# Altium project LSS_Top_Board_v3.4.PrjPcb (part 3 of 3)

## Sheet Connector-Section.SchDoc
size A4; DocumentNumber: 9; SheetNumber: 9; SheetTotal: 10
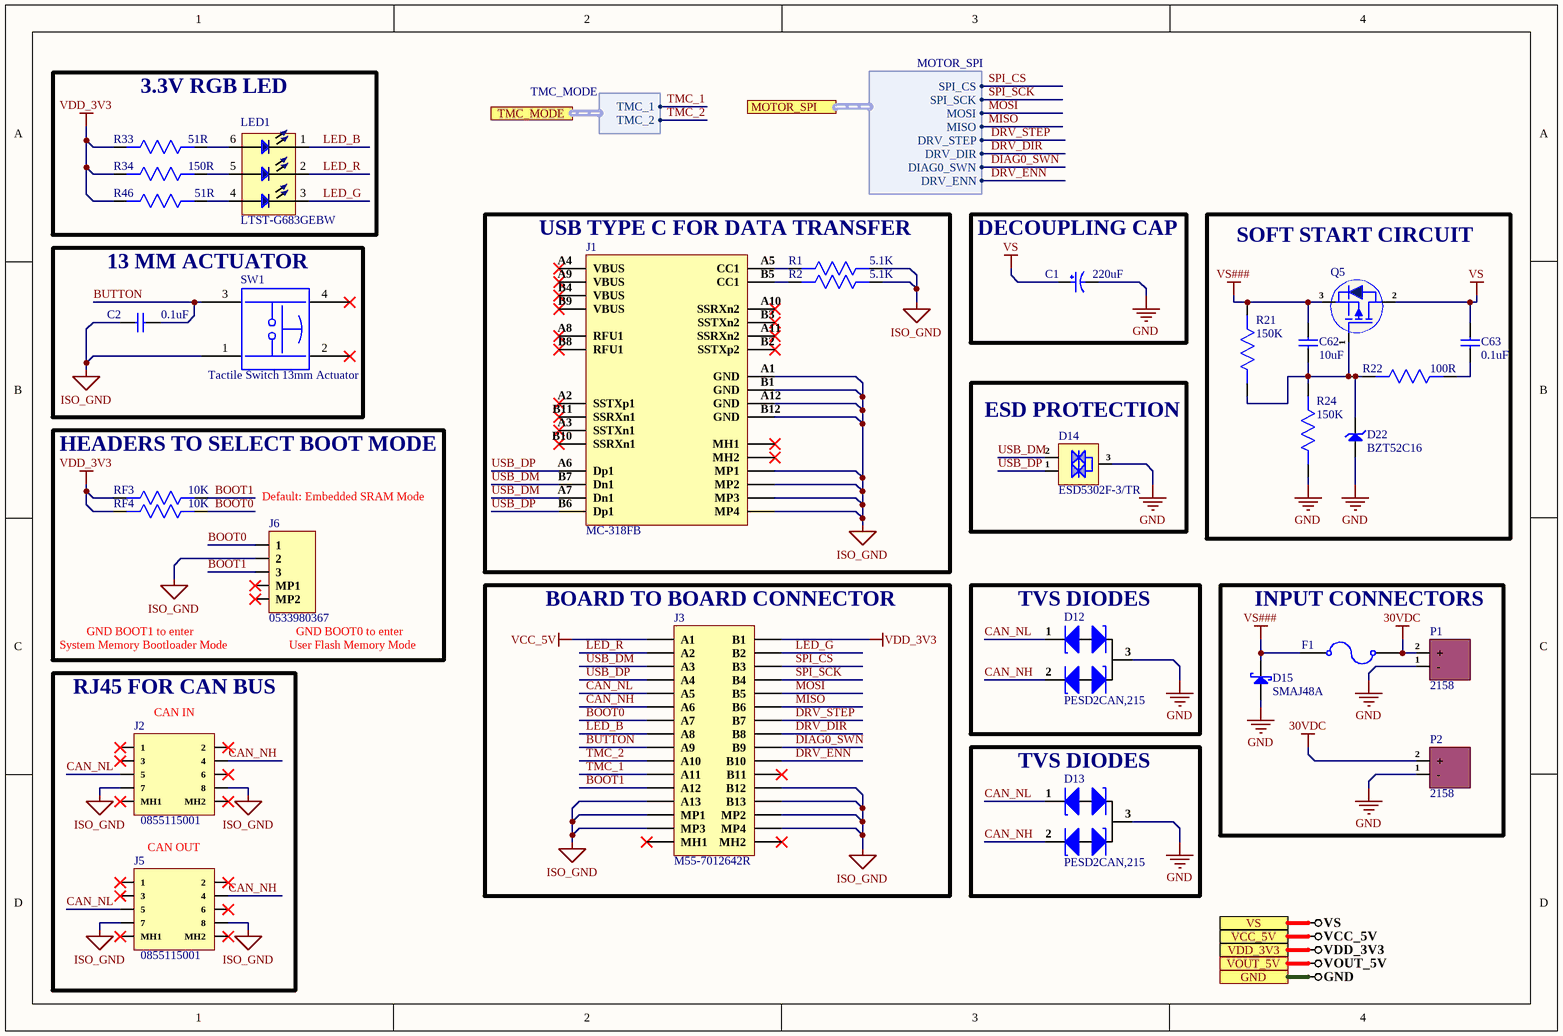
[diagram p3: Connector-Section.SchDoc]

### Parts
C1  220uF  [EEEFT1H221AP]
C2  0.1uF  [Cap 0603]
C62  10uF  [Cap 0603]
C63  0.1uF  [Cap 0603]
D12  PESD2CAN,215  [SOT-23]
D13  PESD2CAN,215  [SOT-23]
D14  ESD5302F-3/TR  [Sot-23]
D15  SMAJ48A  [SMA]
D22  BZT52C16  [SOD-123]
F1  0685H9150-01  [0685H9150-01]  (value not drawn)
J1  MC-318FB  [MC-318FB]
J2  0855115001  [0855115001]
J3  M55-7012642R  [M55-7012642R]
J5  0855115001  [0855115001]
J6  0533980367  [0533980367]
LED1  LTST-G683GEBW  [LTST-G683GEBW]
P1  2158  [2158]
P2  2158  [2158]
Q5  STD10P6F6  [DPAK]  (value not drawn)
R1  5.1K  [Res0603]
R2  5.1K  [Res0603]
R21  150K  [Res0603]
R22  100R  [Res0603]
R24  150K  [Res0603]
R33  51R  [Res0603]
R34  150R  [Res0603]
R46  51R  [Res0603]
RF3  10K  [Res0603]
RF4  10K  [Res0603]
SW1  Tactile Switch 13mm Actuator  [Tactile Switch 13mm Actuator]

### Blocks framed on the sheet
3.3V RGB LED: LED1 R33 R34 R46
USB TYPE C FOR DATA TRANSFER: J1 R1 R2
DECOUPLING CAP: C1
SOFT START CIRCUIT: C62 C63 D22 Q5 R21 R22 R24
13 MM ACTUATOR: C2 SW1
ESD PROTECTION: D14
HEADERS TO SELECT BOOT MODE: J6 RF3 RF4
BOARD TO BOARD CONNECTOR: J3
TVS DIODES: D12
INPUT CONNECTORS: D15 F1 P1 P2
RJ45 FOR CAN BUS: J2 J5
TVS DIODES: D13

### Ports
GND, MOTOR_SPI (harness MOTOR_SPI), TMC_MODE (harness TMC_MODE), VCC_5V, VDD_3V3, VOUT_5V, VS

### Harnesses
TMC_MODE: TMC_1, TMC_2
MOTOR_SPI: SPI_CS, SPI_SCK, MOSI, MISO, DRV_STEP, DRV_DIR, DRV_ENN, DIAG0_SWN

### Nets
30VDC: F1.2 P1.2(+) P2.2(+)
GND: C1.2 D12.3(C_K) D13.3(C_K) D14.3(GND) D15.2(A) D22.1(A) P1.1(-) P2.1(-) R24.2 ; port GND
ISO_GND: C2.1 J1.A1(GND) J1.A12(GND) J1.B1(GND) J1.B12(GND) J1.MP1 J1.MP2 J1.MP3 J1.MP4 J2.7 J2.8 J3.A13 J3.B12 J3.B13 J3.MP1 J3.MP2 J3.MP3 J3.MP4 J5.7 J5.8 J6.2 R1.1 R2.1 SW1.1
VCC_5V: J3.A1 ; port VCC_5V  [project net 5V]
VDD_3V3: J3.B1 R33.2 R34.2 R46.2 RF3.2 RF4.2 ; port VDD_3V3
VS: C1.1 C63.2 Q5.2(D) ; port VS
VS###: C62.2 D15.1(K) F1.1 Q5.3(S) R21.1
BOOT0: J3.A7 J6.1 RF4.1
BOOT1: J3.A12 J6.3 RF3.1
BUTTON: C2.2 J3.A9 SW1.3
CAN_NH: D12.2(K2) D13.2(K2) J2.4 J3.A6 J5.4
CAN_NL: D12.1(K1) D13.1(K1) J2.5 J3.A5 J5.5
DIAG0_SWN: J3.B9 ; port MOTOR_SPI.DIAG0_SWN
DRV_DIR: J3.B8 ; port MOTOR_SPI.DRV_DIR
DRV_ENN: J3.B10 ; port MOTOR_SPI.DRV_ENN
DRV_STEP: J3.B7 ; port MOTOR_SPI.DRV_STEP
LED_B: J3.A8 LED1.1(-)
LED_G: J3.B2 LED1.3(-)
LED_R: J3.A2 LED1.2(-)
MISO: J3.B6 ; port MOTOR_SPI.MISO
MOSI: J3.B5 ; port MOTOR_SPI.MOSI
SPI_CS: J3.B3 ; port MOTOR_SPI.SPI_CS
SPI_SCK: J3.B4 ; port MOTOR_SPI.SPI_SCK
TMC_1: J3.A11 ; port TMC_MODE.TMC_1
TMC_2: J3.A10 ; port TMC_MODE.TMC_2
USB_DM: D14.2(I/O2) J1.A7(Dn1) J1.B7(Dn1) J3.A3
USB_DP: D14.1(I/O1) J1.A6(Dp1) J1.B6(Dp1) J3.A4
NetC62_1: C62.1 D22.2(K) Q5.1(G) R21.2 R22.2 R24.1
NetC63_1: C63.1 R22.1
NetJ1_A5: J1.A5(CC1) R1.2
NetJ1_B5: J1.B5(CC1) R2.2
NetLED1_4: LED1.4(+) R46.1
NetLED1_5: LED1.5(+) R34.1
NetLED1_6: LED1.6(+) R33.1

Not connected (* = marked no-connect by the designer): J1 A2(SSTXp1)* A3(SSTXn1)* A4(VBUS)* A8(RFU1)* A9(VBUS)* A10(SSRXn2)* A11(SSRXn2)* B2(SSTXp2)* B3(SSTXn2)* B4(VBUS)* B8(RFU1)* B9(VBUS)* B10(SSRXn1)* B11(SSRXn1)* MH1* MH2*; J2 1* 2* 3* 6* MH1* MH2*; J3 B11* MH1* MH2*; J5 1* 2* 3* 6* MH1* MH2*; J6 MP1* MP2*; SW1 2* 4*

### Notes on the sheet
- (near J6) Default: Embedded SRAM Mode
- (near J6) System Memory Bootloader Mode
- GND BOOT1 to enter
- (near J6) User Flash Memory Mode
- (near J6) GND BOOT0 to enter
- (near J2) CAN IN
- CAN OUT

### Library data of the parts
C1 = EEEFT1H221AP: CAP ALUM 220UF 20% 50V SMD; Manufacturer: Panasonic; Dielectric Material: Aluminium; Ripple Current: 670mA; ESR (Equivalent Series Resistance): 180mR; Life (Hours): 2000Hour; Leakage Current: 110uA; Lead Diameter: 0.9mm; Item Type: Capacitor; Supplier 1: Avnet; Manufacturer Part Number: EEEFT1H221AP; RoHS: Yes; Category: Aluminum Electrolytic Capacitors; Stock 1: 22638; Pricing 1: 1=1.43000, 10=1.11000, 25=1.01000, 50=0.90500, 100=0.80400 (USD); Mount: Surface Mount,PCB; Case/Package: Radial; Number of Pins: 2; Contact Plating: Tin; Min Operating Temperature: -55°C; Max Operating Temperature: 105°C; Capacitance: 220uF; Voltage Rating: 50V; Tolerance: 20%; Packaging: Tape and Reel; Package Quantity: 500; Ripple Current (AC): 670mA; Voltage Rating (DC): 50V; Termination: SMD/SMT; Voltage: 50V; Series: FT; Construction: Cylindrical; Diameter: 8mm; Length: 10.2mm; Height: 10.2mm; Lead Pitch: 3.1mm; Height - Seated (Max): 0.413inch; Ratings: AEC-Q200; Radiation Hardening: No; Reach SVHC Compliant: Yes; Lead Free: Lead Free; RoHS Compliant: Yes; ComponentLink1URL: https://datasheet.ciiva.com/11783/0900766b80f4973e-11783665.pdf?src-supplier=RSComponents; ComponentLink1Description: https://datasheet.ciiva.com/11783/0900766b80f4973e-11783665.pdf?src-supplier=RSComponents; ComponentLink2URL: https://datasheet.ciiva.com/48523/smd-ft-eng-tds-48523263.pdf?src-supplier=Distrelec; ComponentLink2Description: https://datasheet.ciiva.com/48523/smd-ft-eng-tds-48523263.pdf?src-supplier=Distrelec; ComponentLink3URL: https://datasheet.ciiva.com/43458/1790597-43458703.pdf?src-supplier=Farnell; ComponentLink3Description: https://datasheet.ciiva.com/43458/1790597-43458703.pdf?src-supplier=Farnell; ComponentLink4URL: https://datasheet.ciiva.com/6025/1790597-6025836.pdf?src-supplier=Farnell; ComponentLink4Description: https://datasheet.ciiva.com/6025/1790597-6025836.pdf?src-supplier=Farnell; ComponentLink5URL: https://datasheet.ciiva.com/46376/1790597-46376766.pdf?src-supplier=Element14; ComponentLink5Description: https://datasheet.ciiva.com/46376/1790597-46376766.pdf?src-supplier=Element14; ComponentLink6URL: https://datasheet.ciiva.com/28691/1244238-28691159.pdf?src-supplier=Element14; ComponentLink6Description: https://datasheet.ciiva.com/28691/1244238-28691159.pdf?src-supplier=Element14; ComponentLink7URL: https://datasheet.ciiva.com/28691/1244238-28691150.pdf?src-supplier=Element14; ComponentLink7Description: https://datasheet.ciiva.com/28691/1244238-28691150.pdf?src-supplier=Element14; ComponentLink8URL: https://datasheet.ciiva.com/46385/1790597-46385166.pdf?src-supplier=Element14; ComponentLink8Description: https://datasheet.ciiva.com/46385/1790597-46385166.pdf?src-supplier=Element14; ComponentLink9URL: https://datasheet.ciiva.com/24070/aba0000ce135-31031-24070059.pdf?src-supplier=Mouser; ComponentLink9Description: https://datasheet.ciiva.com/24070/aba0000ce135-31031-24070059.pdf?src-supplier=Mouser; ComponentLink10URL: https://datasheet.ciiva.com/14599/70243693-14599500.pdf?src-supplier=Allied+Electronics; ComponentLink10Description: https://datasheet.ciiva.com/14599/70243693-14599500.pdf?src-supplier=Allied+Electronics; ComponentLink11URL: https://datasheet.ciiva.com/14607/70243693-14607598.pdf?src-supplier=Allied+Electronics; ComponentLink11Description: https://datasheet.ciiva.com/14607/70243693-14607598.pdf?src-supplier=Allied+Electronics; ComponentLink12URL: https://datasheet.ciiva.com/14606/70243693-14606280.pdf?src-supplier=Allied+Electronics; ComponentLink12Description: https://datasheet.ciiva.com/14606/70243693-14606280.pdf?src-supplier=Allied+Electronics; ComponentLink13URL: https://datasheet.ciiva.com/10331/aba0000ce135-10331093.pdf?src-supplier=Avnet; ComponentLink13Description: https://datasheet.ciiva.com/10331/aba0000ce135-10331093.pdf?src-supplier=Avnet; ComponentLink14URL: https://datasheet.ciiva.com/30060/aba0000ce135-30060199.pdf?src-supplier=Onlinecomponents.com; ComponentLink14Description: https://datasheet.ciiva.com/30060/aba0000ce135-30060199.pdf?src-supplier=Onlinecomponents.com; Supplier Part Number 1: 31T8183; LCSC Part Number: C178594
C2 C63 = CL10B104KB8NNNC: Cap Ceramic 0.1uF 50VDC X7R 10% SMD 0603 Paper T/R; Manufacturer: Samsung; Capacitance: 100nF; Voltage Rating: 50V; Supplier 1: Digi-Key; Manufacturer Part Number: CL10B104KB8NNNC; RoHS: Yes; Category: Ceramic Capacitors; Stock 1: 3998791; Pricing 1: 1=0.10000, 10=0.03000, 50=0.01640, 100=0.01340, 500=0.00954, 1000=0.00750 (USD); Mount: Surface Mount; Case/Package: 0603; Case Code (Metric): 1608; Case Code (Imperial): 0603; Material: Ceramic; Contact Plating: Tin; Min Operating Temperature: -55°C; Max Operating Temperature: 125°C; Dielectric: X7R; Tolerance: 10%; Package Quantity: 1; Packaging: Tape and Reel; Voltage: 50V; Voltage Rating (DC): 50V; Series: CL; Construction: Flat; Length: 1.6mm; Width: 0.031inch; Height: 0.8mm; Depth: 0.8mm; Thickness: 0.035inch; Radiation Hardening: No; Lead Free: Lead Free; RoHS Compliant: Yes; ComponentLink1URL: https://datasheet.ciiva.com/25803/cl10b104kb8nnnc-25803393.pdf?src-supplier=Digi-Key; ComponentLink1Description: https://datasheet.ciiva.com/25803/cl10b104kb8nnnc-25803393.pdf?src-supplier=Digi-Key; ComponentLink2URL: https://datasheet.ciiva.com/26838/getdatasheetpartid-89097-26838411.pdf?src-supplier=Verical; ComponentLink2Description: https://datasheet.ciiva.com/26838/getdatasheetpartid-89097-26838411.pdf?src-supplier=Verical; ComponentLink3URL: https://datasheet.ciiva.com/29198/456651-da-01-en-vs-kondensator-0605-29198839.pdf?src-supplier=Conrad; ComponentLink3Description: https://datasheet.ciiva.com/29198/456651-da-01-en-vs-kondensator-0605-29198839.pdf?src-supplier=Conrad; Supplier Part Number 1: 1276-1000-1-ND
C62 = GRM188R6YA106MA73D: 10uF 35V X5R 20% Pad SMD 0603; Manufacturer: Murata; Supplier 1: Arrow Electronics; Manufacturer Part Number: GRM188R6YA106MA73D; RoHS: Yes; Category: Ceramic Capacitors; Stock 1: 37601; Pricing 1: 1=0.36650, 10=0.23380, 25=0.23160, 100=0.15050, 250=0.14890, 500=0.10700, 1000=0.09270, 3000=0.08640, 6000=0.07720, 15000=0.07140, 30000=0.05840 (USD); Mount: Surface Mount; Case/Package: 0603; Case Code (Metric): 1608; Case Code (Imperial): 0603; Min Operating Temperature: -55°C; Max Operating Temperature: 85°C; Packaging: Tape and Reel; Capacitance: 10uF; Voltage Rating: 35V; Tolerance: 20%; Voltage Rating (DC): 35V; Dielectric: X5R; Length: 0.063inch; Width: 0.031inch; Thickness: 0.039inch; RoHS Compliant: Yes; ComponentLink1URL: http://search.murata.co.jp/Ceramy/image/img/A01X/G101/ENG/GRM188R6YA106MA73-01.pdf?src-supplier=Future+Electronics; ComponentLink1Description: http://search.murata.co.jp/Ceramy/image/img/A01X/G101/ENG/GRM188R6YA106MA73-01.pdf?src-supplier=Future+Electronics; ComponentLink2URL: http://search.murata.co.jp/Ceramy/image/img/A01X/G101/ENG/GRM188R6YA106MA73-01.pdf?src-supplier=Digi-Key; ComponentLink2Description: http://search.murata.co.jp/Ceramy/image/img/A01X/G101/ENG/GRM188R6YA106MA73-01.pdf?src-supplier=Digi-Key; ComponentLink3URL: https://www.murata.com/~/media/webrenewal/support/library/catalog/products/capacitor/mlcc/c02e.ashx?la=en-us&src-supplier=Digi-Key; ComponentLink3Description: https://www.murata.com/~/media/webrenewal/support/library/catalog/products/capacitor/mlcc/c02e.ashx?la=en-us&src-supplier=Digi-Key; ComponentLink4URL: http://search.murata.co.jp/Ceramy/image/img/A01X/G101/ENG/GRM188R6YA106MA73-01.pdf?src-supplier=Mouser; ComponentLink4Description: http://search.murata.co.jp/Ceramy/image/img/A01X/G101/ENG/GRM188R6YA106MA73-01.pdf?src-supplier=Mouser; ComponentLink5URL: http://search.murata.co.jp/Ceramy/image/img/A01X/G101/ENG/GRM188R6YA106MA73-01.pdf?src-supplier=TTI; ComponentLink5Description: http://search.murata.co.jp/Ceramy/image/img/A01X/G101/ENG/GRM188R6YA106MA73-01.pdf?src-supplier=TTI; Supplier Part Number 1: GRM188R6YA106MA73D
D12 D13 = PESD2CAN,215: TVS DIODE 24VWM 41VC TO236AB; Manufacturer: Nexperia; Supplier 1: Arrow Electronics; Manufacturer Part Number: PESD2CAN,215; RoHS: No; Category: ESD and Circuit Protection ICs; Stock 1: 775; Pricing 1: 1=0.48690, 10=0.40120, 25=0.38650, 50=0.33780, 100=0.25440, 250=0.25380, 500=0.25120 (USD); ComponentLink1URL: http://www.farnell.com/datasheets/1750978.pdf?src-supplier=Farnell; ComponentLink1Description: http://www.farnell.com/datasheets/1750978.pdf?src-supplier=Farnell; ComponentLink2URL: https://assets.nexperia.com/documents/data-sheet/PESD2CAN.pdf?src-supplier=Digi-Key; ComponentLink2Description: https://assets.nexperia.com/documents/data-sheet/PESD2CAN.pdf?src-supplier=Digi-Key; ComponentLink3URL: http://www.farnell.com/datasheets/1750978.pdf?src-supplier=Newark; ComponentLink3Description: http://www.farnell.com/datasheets/1750978.pdf?src-supplier=Newark; Supplier Part Number 1: PESD2CAN,215
D14 = ESD5302F-3/TR: 16A 20V 7V 5V@Max Unidirectional SOT-23 TVS ROHS; Manufacturer: WILLSEMI; Item Type: Diode; Manufacturer Part Number: ESD5302F-3/TR; Package: SOT-23; LCSC Part Number: C239643; ComponentLink1Description: LCSC; ComponentLink1URL: https://www.lcsc.com/product-detail/TVS_WILLSEMI-Will-Semicon-ESD5302F-3-TR_C239643.html
D15 = SMAJ48A: TVS DIODE 48VWM 77.4VC DO214AC; Manufacturer: Littelfuse; Polarity: Unidirectional; Breakdown Voltage: 53.3V; Peak Pulse Power: 400W; Reverse Standoff Voltage: 48V; Peak Pulse Current: 5.2A; Clamping Voltage: 77.4V; Number of Unidirectional Channels: 1; Power Line Protection: No; Test Current: 1mA; Diode Type: ZENER; Max Power Dissipation: 3.3W; Leakage Current: 1uA; Max Breakdown Voltage: 58.9V; Manufacturer Part Number: SMAJ48A; Package: SMA(DO-214AC); LCSC Part Number: C223991; Item Type: TVS  Diode; ComponentLink1Description: LCSC; Supplier: Rs; Supplier Part Number: 1719659; RoHS: Yes; Category: TVS Diodes; Stock: 2975; Pricing: 25=0.231, 100=0.214, 500=0.209, 1000=0.204 (GBP); Mounting Technology: Surface Mount; Case/Package: DO-214AC; Pins: 2; Min Operating Temperature: -65°C; Max Operating Temperature: 150°C; Min Breakdown Voltage: 53.3V; Packaging: Tape and Reel; Package Quantity: 5000; Max Surge Current: 5.2A; Series: SMAJ; Operating Supply Voltage: 48V; Direction: Unidirectional; Termination: SMD/SMT; Number of Channels: 1; Reverse Breakdown Voltage: 53.3V; Number of Elements: 1; Voltage Rating (DC): 48V; Power Dissipation: 400W; Clamping Voltage-Max: 77.4V; Length: 5.28mm; Width: 2.79mm; Height: 2.29mm; RoHS Compliant: Yes; Reach SVHC Compliant: No; Lead Free: Lead Free; ComponentLink2URL: https://datasheet.ciiva.com/28649/607617-28649159.pdf?src-supplier=Element14; ComponentLink2Description: https://datasheet.ciiva.com/28649/607617-28649159.pdf?src-supplier=Element14; ComponentLink3URL: https://datasheet.ciiva.com/16391/littelfuse-tvs-diode-smaj-16391798.pdf?src-supplier=Future+Electronics; ComponentLink3Description: https://datasheet.ciiva.com/16391/littelfuse-tvs-diode-smaj-16391798.pdf?src-supplier=Future+Electronics; ComponentLink4URL: https://datasheet.ciiva.com/330/littelfuse-tvs-diode-smaj-datasheet-pdf-330802.pdf?src-supplier=Digi-Key; ComponentLink4Description: https://datasheet.ciiva.com/330/littelfuse-tvs-diode-smaj-datasheet-pdf-330802.pdf?src-supplier=Digi-Key; ComponentLink5URL: https://datasheet.ciiva.com/330/littelfuse-tvs-diode-smaj-datasheet-pdf-330803.pdf?src-supplier=Digi-Key; ComponentLink5Description: https://datasheet.ciiva.com/330/littelfuse-tvs-diode-smaj-datasheet-pdf-330803.pdf?src-supplier=Digi-Key; ComponentLink6URL: https://datasheet.ciiva.com/330/littelfuse-tvs-diode-smaj-datasheet-pdf-330804.pdf?src-supplier=Digi-Key; ComponentLink6Description: https://datasheet.ciiva.com/330/littelfuse-tvs-diode-smaj-datasheet-pdf-330804.pdf?src-supplier=Digi-Key
D22 = BZT52C16: ±5% Single 15.3V~17.1V 500mW 16V SOD-123 Zener Diodes ROHS; Manufacturer: Shikues; Manufacturer Part Number: BZT52C16; Package: SOD-123; LCSC Part Number: C216724; Item Type: Zener Diode; ComponentLink1Description: LCSC; ComponentLink1URL: https://www.lcsc.com/product-detail/Zener-Diodes_Shikues-BZT52C16_C216724.html
F1 = 0685H9150-01: FUSE BOARD MNT 15A 125VAC 32VDC; Manufacturer: Bel; Fuse Type: Board Mount (Cartridge Style Excluded); Voltage Rating (AC): 125V; Voltage Rating (DC): 32V; DC Cold Resistance: 2.6mR; Approvals: cURus; Supplier 1: Digi-Key; Manufacturer Part Number: 0685H9150-01; RoHS: Yes; Category: Fuses; Stock 1: 31788; Pricing 1: 1=0.29000, 5=0.27800, 10=0.26600, 50=0.23780, 100=0.22140, 250=0.19680, 500=0.16400, 1000=0.15580 (USD); Mount: Surface Mount; Case/Package: 1206; Case Code (Imperial): 1206; Case Code (Metric): 3216; Min Operating Temperature: -55°C; Max Operating Temperature: 125°C; Packaging: Tape and Reel; Current Rating: 15A; RoHS Compliant: Yes; ComponentLink1URL: http://www.farnell.com/datasheets/2571626.pdf?src-supplier=Farnell; ComponentLink1Description: http://www.farnell.com/datasheets/2571626.pdf?src-supplier=Farnell; ComponentLink2URL: http://www.farnell.com/datasheets/2571626.pdf?src-supplier=Newark; ComponentLink2Description: http://www.farnell.com/datasheets/2571626.pdf?src-supplier=Newark; ComponentLink3URL: https://belfuse.com/resources/datasheets/circuitprotection/ds-cp-c1h-series.pdf?src-supplier=Digi-Key; ComponentLink3Description: https://belfuse.com/resources/datasheets/circuitprotection/ds-cp-c1h-series.pdf?src-supplier=Digi-Key; Supplier Part Number 1: 507-1944-1-ND
J1 = MC-318FB: USB 3.0 3A 1 Brick nogging 24 Female -35℃~+75℃ Type-C SMD USB Connectors ROHS; Manufacturer: SOFNG; ComponentLink1Description: LCSC; ComponentLink1URL: https://www.lcsc.com/product-detail/USB-Connectors_SOFNG-MC-318FB_C2977724.html; Manufacturer Part Number: MC-318FB; Footprint: Custom
J2 J5 = 0855115001: CONN MOD JACK 8P8C VERT UNSHLD; Manufacturer: Molex; Manufacturer Part Number: 85511-5001; Number of Ports: 1; Gender: Female; Current Rating: 1.5A; Shielding: Unshielded; Voltage Rating: 125V; Number of Contacts: 8; Connector Type: PCB; Pitch: 2.54mm; Item Type: Ethernet Connector; Supplier 1: Mouser; RoHS: Yes; Category: Modular / Ethernet Connectors; Stock 1: 2609; Pricing 1: 1=2.18, 10=1.62, 50=1.62, 100=1.56, 1000=1.37, 10000=1.36 (USD); Mounting Technology: Through Hole; Contact Plating: Gold; Contact Material: Bronze; Housing Material: Thermoplastic; Min Operating Temperature: -40°C; Max Operating Temperature: 80°C; Packaging: Tray; Orientation: Straight; Package Quantity: 2618; Termination: Through Hole; Number of Positions: 8; Series: 85511; Radiation Hardening: No; RoHS Compliant: Yes; Reach SVHC Compliant: Unknown; ComponentLink1URL: https://datasheet.ciiva.com/8042/1598510-8042692.pdf?src-supplier=Element14; ComponentLink1Description: https://datasheet.ciiva.com/8042/1598510-8042692.pdf?src-supplier=Element14; ComponentLink2URL: https://datasheet.ciiva.com/34305/0855115001-modular-jacks-plug-34305578.pdf?src-supplier=Onlinecomponents.com; ComponentLink2Description: https://datasheet.ciiva.com/34305/0855115001-modular-jacks-plug-34305578.pdf?src-supplier=Onlinecomponents.com; ComponentLink3URL: https://datasheet.ciiva.com/4562/0855115001-modular-jacks-plug-175812-4562506.pdf?src-supplier=Mouser; ComponentLink3Description: https://datasheet.ciiva.com/4562/0855115001-modular-jacks-plug-175812-4562506.pdf?src-supplier=Mouser; ComponentLink4URL: https://datasheet.ciiva.com/9392/0855115001-modular-jacks-plug-9392966.pdf?src-supplier=Avnet; ComponentLink4Description: https://datasheet.ciiva.com/9392/0855115001-modular-jacks-plug-9392966.pdf?src-supplier=Avnet; Supplier Part Number 1: 538-85511-5001
J3 = M55-7012642R: CONN HEADER SMD 26POS 1.27MM; Manufacturer: Harwin; Supplier 1: Digi-Key; Manufacturer Part Number: M55-7012642R; RoHS: Yes; Category: Connectors; Stock 1: 384; Pricing 1: 1=1.43000, 10=1.24900, 100=1.11570 (USD); RoHS Compliant: Yes; Supplier Part Number 1: 952-3878-1-ND
J6 = 0533980367: CONN HEADER SMD 3POS 1.25MM; Manufacturer: Molex; Supplier: Mouser; Supplier Part Number: 538-53398-0367; Manufacturer Part Number: 0533980367; RoHS: Yes; Stock: 6777; Pricing: 1=1.41, 10=1.16, 50=1.16, 100=0.963, 1000=0.77, 10000=0.625 (USD); ComponentLink1URL: https://datasheet.ciiva.com/2944/533980367-sd-2944045.pdf?src-supplier=Digi-Key; ComponentLink1Description: https://datasheet.ciiva.com/2944/533980367-sd-2944045.pdf?src-supplier=Digi-Key
LED1 = LTST-G683GEBW: Standard LEDs - SMD SMD LED Red/Grn/Blue 625/1550/260 mcd; Manufacturer: Vishay Lite-On; Color: Blue,Green,Red; Luminous Intensity: 267.5mcd; Viewing Angle: 120°; Lens Style: Diffused,Circular; Forward Voltage: 3.8V; Forward Current: 20mA; Lens Transparency: Diffused; Dominant Wavelength: 525nm; Number of Elements: 3; Reverse Voltage: 5V; Supplier 1: Mouser; Manufacturer Part Number: LTST-G683GEBW; RoHS: Yes; Category: LEDs; Stock 1: 43790; Pricing 1: 1=0.51000, 10=0.46000, 50=0.46000, 100=0.34600, 500=0.29900, 1000=0.23600, 2000=0.21200, 10000=0.20900, 24000=0.20400, 50000=0.19700 (USD); Mount: Surface Mount; Case/Package: PLCC; Number of Pins: 6; Min Operating Temperature: -40°C; Max Operating Temperature: 85°C; Packaging: Tape and Reel; Package Quantity: 2000; Test Current: 20mA; Number of LEDs: 3; Series: -; Length: 3.3mm; Width: 3mm; Height: 1.45mm; Depth: 3.2mm; Radiation Hardening: No; Lead Free: Lead Free; RoHS Compliant: Yes; ComponentLink1URL: https://datasheet.ciiva.com/2959/s-110-ltst-g683gebw-2959963.pdf?src-supplier=Digi-Key; ComponentLink1Description: https://datasheet.ciiva.com/2959/s-110-ltst-g683gebw-2959963.pdf?src-supplier=Digi-Key; ComponentLink2URL: https://datasheet.ciiva.com/12403/s-110-ltst-g683gebw-337108-12403142.pdf?src-supplier=Mouser; ComponentLink2Description: https://datasheet.ciiva.com/12403/s-110-ltst-g683gebw-337108-12403142.pdf?src-supplier=Mouser; Supplier Part Number 1: 859-LTST-G683GEBW
P1 P2 = 2158: XT60 Connector Male-Female Pair, Black (Pololu); Manufacturer: Polulo; Item Type: Power Connector; Manufacturer Part Number: 2158; Package: Custom
Q5 = STD10P6F6: MOSFET P CH 60V 10A DPAK; Manufacturer: STMicroelectronics; Supplier: Mouser; Supplier Part Number: 511-STD10P6F6; Manufacturer Part Number: STD10P6F6; RoHS: Yes; Category: MOSFETs; Stock: 73; Pricing: 1=1.13, 10=1.01, 50=1.01, 100=0.783, 500=0.647, 1000=0.511, 2500=0.477, 10000=0.477 (USD); ComponentLink1URL: https://datasheet.ciiva.com/13063/dm00051198-211735-13063452.pdf?src-supplier=Mouser; ComponentLink1Description: https://datasheet.ciiva.com/13063/dm00051198-211735-13063452.pdf?src-supplier=Mouser; ComponentLink2URL: https://datasheet.ciiva.com/6380/dm00051198-6380394.pdf?src-supplier=Digi-Key; ComponentLink2Description: https://datasheet.ciiva.com/6380/dm00051198-6380394.pdf?src-supplier=Digi-Key; ComponentLink3URL: https://datasheet.ciiva.com/6380/dm00051198-6380397.pdf?src-supplier=Digi-Key; ComponentLink3Description: https://datasheet.ciiva.com/6380/dm00051198-6380397.pdf?src-supplier=Digi-Key; ComponentLink4URL: https://datasheet.ciiva.com/16220/dm00051198-16220460.pdf?src-supplier=Future+Electronics; ComponentLink4Description: https://datasheet.ciiva.com/16220/dm00051198-16220460.pdf?src-supplier=Future+Electronics; LCSC Part Number: C457501; Item Type: MOSFET
R1 R2 = RC0603JR-075K1L: RES SMD 5.1K OHM 5% 1/10W 0603; Manufacturer: Yageo; Resistance: 5.1kR; Power Rating: 100mW; Voltage Rating: 50V; Temperature Coefficient: 100ppm/°C; Supplier 1: Digi-Key; Manufacturer Part Number: RC0603JR-075K1L; RoHS: Yes; Category: Chip SMD Resistors; Stock 1: 245818; Pricing 1: 1=0.10000, 10=0.02000, 100=0.00800, 1000=0.00360, 2500=0.00312 (USD); Case/Package: 0603; Number of Pins: 2; Case Code (Imperial): 0603; Case Code (Metric): 1608; Size Code: 0603; Min Operating Temperature: -55°C; Max Operating Temperature: 155°C; Tolerance: 5%; Packaging: Tape and Reel; Termination: SMD/SMT; Resistor Type: Thick Film; Voltage Rating (DC): 50V; Features: Moisture Resistant; Series: RC; Max Power Dissipation: 100mW; Number of Terminations: 2; Resistance Tolerance: 5%; Construction: Rectangular; Length: 1.6mm; Depth: 0.8mm; REACH SVHC: No SVHC; Military Standard: Not; Lead Free: Lead Free; RoHS Compliant: Yes; ComponentLink1URL: http://www.mouser.com/ds/2/447/RC0603-272842.pdf?src-supplier=Mouser; ComponentLink1Description: http://www.mouser.com/ds/2/447/RC0603-272842.pdf?src-supplier=Mouser; ComponentLink2URL: http://components.arrow.com/part/dataview/0323_00047491?src-supplier=Arrow+Europe; ComponentLink2Description: http://components.arrow.com/part/dataview/0323_00047491?src-supplier=Arrow+Europe; ComponentLink3URL: http://www.farnell.com/datasheets/2167052.pdf?src-supplier=Farnell; ComponentLink3Description: http://www.farnell.com/datasheets/2167052.pdf?src-supplier=Farnell; ComponentLink4URL: http://www.farnell.com/datasheets/2167052.pdf?src-supplier=Element14; ComponentLink4Description: http://www.farnell.com/datasheets/2167052.pdf?src-supplier=Element14; ComponentLink5URL: http://www.farnell.com/datasheets/2167052.pdf?src-supplier=Newark; ComponentLink5Description: http://www.farnell.com/datasheets/2167052.pdf?src-supplier=Newark; ComponentLink6URL: http://www.farnell.com/datasheets/1868787.pdf?src-supplier=Newark; ComponentLink6Description: http://www.farnell.com/datasheets/1868787.pdf?src-supplier=Newark; ComponentLink7URL: http://www.yageo.com/documents/recent/PYu-RC_Group_51_RoHS_L_10.pdf?src-supplier=Digi-Key; ComponentLink7Description: http://www.yageo.com/documents/recent/PYu-RC_Group_51_RoHS_L_10.pdf?src-supplier=Digi-Key; ComponentLink8URL: http://www.yageo.com/documents/recent/PYu-RC0603_51_RoHS_L_7.pdf?src-supplier=Future+Electronics; ComponentLink8Description: http://www.yageo.com/documents/recent/PYu-RC0603_51_RoHS_L_7.pdf?src-supplier=Future+Electronics; Supplier Part Number 1: 311-5.1KGRCT-ND
R21 R24 = AC0603JR-07150KL: RES SMD 150K OHM 5% 1/10W 0603; Manufacturer: Yageo; Voltage Rating: 50V; Power Rating: 100mW; Resistance: 150kR; Temperature Coefficient: 100ppm/°C; Supplier 1: RSComponents; Manufacturer Part Number: AC0603JR-07150KL; RoHS: Yes; Category: Chip SMD Resistors; Stock 1: 11500; Pricing 1: 2500=0.00800, 5000=0.00700, 7500=0.00700, 10000=0.00600 (GBP); Case/Package: 0603; Case Code (Imperial): 0603; Case Code (Metric): 1608; Weight: 7.1E-05oz; Min Operating Temperature: -55°C; Max Operating Temperature: 155°C; Packaging: Tape and Reel; Tolerance: 5%; Resistor Type: Thick Film; Number of Terminations: 2; Termination: SMD/SMT; Max Power Dissipation: 100mW; Features: Moisture Resistant,Automotive AEC-Q200; Series: AC; Length: 0.063inch; Width: 0.031inch; Height: 0.022inch; RoHS Compliant: Yes; ComponentLink1URL: https://datasheet.ciiva.com/12576/pyu-ac-51-rohs-l-2-12576426.pdf?src-supplier=Mouser; ComponentLink1Description: https://datasheet.ciiva.com/12576/pyu-ac-51-rohs-l-2-12576426.pdf?src-supplier=Mouser; Supplier Part Number 1: 1978118P
R22 = RC0603FR-07100RL: RES SMD 100 OHM 1% 1/10W 0603; Manufacturer: Yageo; Temperature Coefficient: 100ppm/°C; Voltage Rating (DC): 50V; Power Rating: 100mW; Supplier 1: Arrow Electronics; Manufacturer Part Number: RC0603FR-07100RL; RoHS: Yes; Category: Chip SMD Resistors; Stock 1: 3800000; Pricing 1: 5000=0.00300, 5000=0.00200, 5000=0.00450, 50000=0.00410, 500000=0.00230, 2500000=0.00140 (USD); Case/Package: 0603; Number of Pins: 2; Case Code (Imperial): 0603; Case Code (Metric): 1608; Size Code: 0603; Min Operating Temperature: -55°C; Max Operating Temperature: 155°C; Resistance: 100R; Tolerance: 1%; Resistor Type: Thick Film; Packaging: Tape and Reel; Voltage Rating: 50V; Termination: SMD/SMT; Features: Moisture Resistant; Series: RC; Max Power Dissipation: 100mW; Number of Terminations: 2; Construction: Rectangular; Resistance Tolerance: 1%; Technology: THICK FILM; Length: 1.6mm; Width: 0.8mm; Height: 0.45mm; Depth: 0.8mm; REACH SVHC: Unknown; Lead Free: Lead Free; RoHS Compliant: Yes; Military Standard: Not; Supplier Part Number 1: RC0603FR-07100RL
R33 R46 = RC0603FR-0751RL: RES SMD 51R 100mW 0603; Manufacturer: Yageo; Tolerance: 1%; Temperature Coefficient: 100ppm/°C; Voltage Rating: 75V; Voltage Rating (DC): 50V; Supplier 1: Arrow Electronics; Manufacturer Part Number: RC0603FR-0751RL; RoHS: Yes; Category: Chip SMD Resistors; Stock 1: 70000; Pricing 1: 5000=0.00260, 10000=0.00240, 25000=0.00210, 50000=0.00180 (USD); Case/Package: 0603; Contact Plating: Tin,Matte; Case Code (Imperial): 0603; Case Code (Metric): 1608; Weight: 7.1E-05oz; Size Code: 0603; Min Operating Temperature: -55°C; Max Operating Temperature: 155°C; Resistance: 51R; Resistor Type: Thick Film; Power Rating: 100mW; Packaging: Tape and Reel; Package Quantity: 1; Termination: SMD/SMT; Number of Terminations: 2; Max Power Dissipation: 100mW; Features: Moisture Resistant; Series: RC; Resistance Tolerance: 1%; Technology: THICK FILM; Length: 1.6mm; Width: 0.8mm; Height: 0.45mm; Depth: 0.8mm; REACH SVHC: No SVHC; Lead Free: Lead Free; RoHS Compliant: Yes; ComponentLink1URL: https://datasheet.ciiva.com/11808/0900766b80f96399-11808142.pdf?src-supplier=RSComponents; ComponentLink1Description: https://datasheet.ciiva.com/11808/0900766b80f96399-11808142.pdf?src-supplier=RSComponents; ComponentLink2URL: https://datasheet.ciiva.com/46395/443971-46395015.pdf?src-supplier=Element14; ComponentLink2Description: https://datasheet.ciiva.com/46395/443971-46395015.pdf?src-supplier=Element14; ComponentLink3URL: https://datasheet.ciiva.com/2454/pyu-r-int-thick-7-2454445.pdf?src-supplier=Digi-Key; ComponentLink3Description: https://datasheet.ciiva.com/2454/pyu-r-int-thick-7-2454445.pdf?src-supplier=Digi-Key; ComponentLink4URL: https://datasheet.ciiva.com/2454/pyu-r-int-thick-7-2454446.pdf?src-supplier=Digi-Key; ComponentLink4Description: https://datasheet.ciiva.com/2454/pyu-r-int-thick-7-2454446.pdf?src-supplier=Digi-Key; ComponentLink5URL: https://datasheet.ciiva.com/2454/pyu-r-int-thick-7-2454444.pdf?src-supplier=Digi-Key; ComponentLink5Description: https://datasheet.ciiva.com/2454/pyu-r-int-thick-7-2454444.pdf?src-supplier=Digi-Key; Supplier Part Number 1: RC0603FR-0751RL
R34 = RC0603FR-07150RL: RES SMD 150OHM 1/10W 0603; Manufacturer: Yageo; Tolerance: 1%; Power Rating: 100mW; Voltage Rating (DC): 50V; Temperature Coefficient: 100ppm/°C; Supplier 1: Digi-Key; Manufacturer Part Number: RC0603FR-07150RL; RoHS: Yes; Category: Chip SMD Resistors; Stock 1: 263721; Pricing 1: 1=0.10000, 10=0.02400, 100=0.00970, 1000=0.00436, 2500=0.00378 (USD); Case/Package: 0603; Number of Pins: 2; Case Code (Imperial): 0603; Case Code (Metric): 1608; Size Code: 0603; Min Operating Temperature: -55°C; Max Operating Temperature: 155°C; Resistance: 150R; Packaging: Tape and Reel; Voltage Rating: 50V; Package Quantity: 5000; Termination: SMD/SMT; Resistor Type: Thick Film; Features: Moisture Resistant; Series: RC; Max Power Dissipation: 100mW; Number of Terminations: 2; Resistance Tolerance: 1%; Construction: Rectangular; Length: 1.6mm; Width: 0.8mm; Height: 0.45mm; Depth: 0.8mm; REACH SVHC: No SVHC; Lead Free: Lead Free; Military Standard: Not; RoHS Compliant: Yes; ComponentLink1URL: https://datasheet.ciiva.com/46412/443971-46412844.pdf?src-supplier=Element14; ComponentLink1Description: https://datasheet.ciiva.com/46412/443971-46412844.pdf?src-supplier=Element14; ComponentLink2URL: https://datasheet.ciiva.com/46440/1868787-46440893.pdf?src-supplier=Element14; ComponentLink2Description: https://datasheet.ciiva.com/46440/1868787-46440893.pdf?src-supplier=Element14; ComponentLink3URL: https://datasheet.ciiva.com/12555/rc0603-272842-12555301.pdf?src-supplier=Mouser; ComponentLink3Description: https://datasheet.ciiva.com/12555/rc0603-272842-12555301.pdf?src-supplier=Mouser; Supplier Part Number 1: 311-150HRCT-ND
RF3 RF4 = RC0603FR-0710KL: RES SMD 10K Ohm 1% 1/10W 0603; Manufacturer: Yageo; Resistance: 10kR; Temperature Coefficient: 100ppm/°C; Voltage Rating (DC): 50V; Power Rating: 100mW; Voltage Rating: 75V; Supplier 1: Digi-Key; Manufacturer Part Number: RC0603FR-0710KL; RoHS: Yes; Category: Chip SMD Resistors; Stock 1: 25249139; Pricing 1: 1=0.10000, 10=0.02400, 100=0.00970, 1000=0.00436, 2500=0.00378 (USD); Case/Package: 0603; Number of Pins: 2; Case Code (Imperial): 0603; Case Code (Metric): 1608; Weight: 7.1E-05oz; Size Code: 0603; Min Operating Temperature: -55°C; Max Operating Temperature: 155°C; Tolerance: 1%; Resistor Type: Thick Film; Packaging: Tape and Reel; Termination: SMD/SMT; Features: Moisture Resistant; Series: RC; Max Power Dissipation: 100mW; Number of Terminations: 2; Resistance Tolerance: 1%; Construction: Rectangular; Length: 1.6mm; Width: 0.8mm; Height: 0.45mm; Depth: 0.8mm; Lead Pitch: 0.3mm; REACH SVHC: Unknown; Lead Free: Lead Free; Military Standard: Not; RoHS Compliant: Yes; ComponentLink1URL: https://datasheet.ciiva.com/7660/38590-7660789.pdf?src-supplier=Element14; ComponentLink1Description: https://datasheet.ciiva.com/7660/38590-7660789.pdf?src-supplier=Element14; ComponentLink2URL: https://datasheet.ciiva.com/7983/443971-7983596.pdf?src-supplier=Element14; ComponentLink2Description: https://datasheet.ciiva.com/7983/443971-7983596.pdf?src-supplier=Element14; ComponentLink3URL: https://datasheet.ciiva.com/22747/443971-22747519.pdf?src-supplier=Element14; ComponentLink3Description: https://datasheet.ciiva.com/22747/443971-22747519.pdf?src-supplier=Element14; ComponentLink4URL: https://datasheet.ciiva.com/46440/1868787-46440891.pdf?src-supplier=Element14; ComponentLink4Description: https://datasheet.ciiva.com/46440/1868787-46440891.pdf?src-supplier=Element14; ComponentLink5URL: https://datasheet.ciiva.com/7746/1738695-7746239.pdf?src-supplier=Element14; ComponentLink5Description: https://datasheet.ciiva.com/7746/1738695-7746239.pdf?src-supplier=Element14; ComponentLink6URL: https://datasheet.ciiva.com/15189/getdatasheetpartid-409289-15189591.pdf?src-supplier=Verical; ComponentLink6Description: https://datasheet.ciiva.com/15189/getdatasheetpartid-409289-15189591.pdf?src-supplier=Verical; Supplier Part Number 1: 311-10.0KHRCT-ND
SW1 = Tactile Switch 13mm Actuator: Memontary Tactile Push Button Switch 6X6X4.3 / 4.5 / 5/6/7/8/9/10 / 13mm SMD; Manufacturer: WIN ELEC-TECH CO., LTD; Manufacturer Part No: Custum; Package: Custom; Link: https://pl.aliexpress.com/item/4001356961226.html?spm=a2g0o.productlist.0.0.7081462a6lheLU&algo_pvid=c376c5b0-041a-41a5-8550-ffd48044eb94&algo_exp_id=c376c5b0-041a-41a5-8550-ffd48044eb94-0

## Nets that join several sheets
5V: Isolated-Power-Section (C34.1 U4.3), Connector-Section (J3.A1)
GND: Isolated-Power-Section (13 pins), Motor-Supply-Section (19 pins), Connector-Section (9 pins)
ISO_GND: Isolated-Power-Section (14 pins), Connector-Section (24 pins)
VCC_12V: Isolated-Power-Section (6 pins), Motor-Supply-Section (C48.1 FB1.2 R41.2 U5.6)
VDD_3V3: Isolated-Power-Section (FB4.2), Connector-Section (6 pins)
VS: Motor-Supply-Section (5 pins), Connector-Section (C1.1 C63.2 Q5.2)